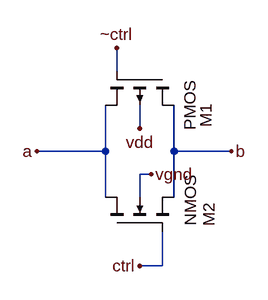
[diagram p0: schematic Transmission_Gate_2.asc]
Transmission_Gate_2.asc, the LTspice schematic file:
Version 4.1
SHEET 1 880 680
WIRE 176 96 176 64
WIRE 208 176 208 144
WIRE 160 208 160 144
WIRE 160 208 64 208
WIRE 256 208 256 144
WIRE 336 208 256 208
WIRE 224 240 208 240
WIRE 160 272 160 208
WIRE 208 272 208 240
WIRE 256 272 256 208
WIRE 240 368 240 320
WIRE 240 368 208 368
FLAG 224 240 vgnd
FLAG 208 176 vdd
FLAG 336 208 b
FLAG 64 208 a
FLAG 208 368 ctrl
FLAG 176 64 ~ctrl
SYMBOL pmos4 256 96 R90
WINDOW 0 45 -45 Left 2
WINDOW 3 12 -22 Left 2
SYMATTR InstName M1
SYMBOL nmos4 160 320 R270
WINDOW 0 7 145 Left 2
WINDOW 3 8 119 Left 2
SYMATTR InstName M2

The netlist it stands for:
* Transmission_Gate_2.asc
M1 b ~ctrl a vdd PMOS
M2 a ctrl b vgnd NMOS
.model NMOS NMOS
.model PMOS PMOS
.lib standard.mos
.backanno
.end